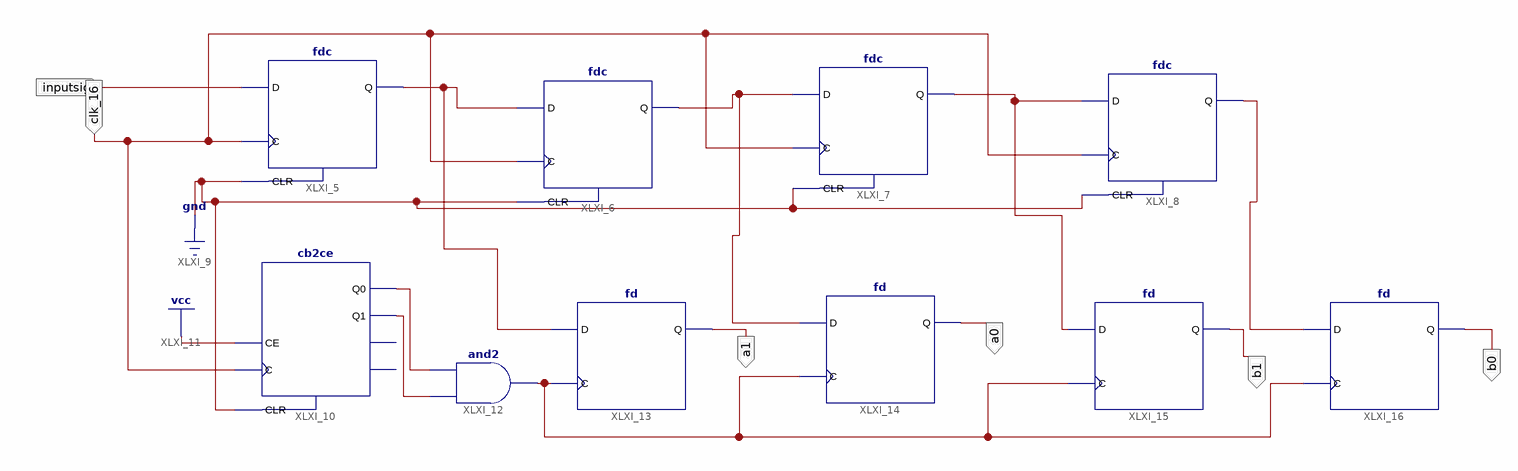
[diagram p0: schematic sheet 1]
// Xilinx ISE schematic bit4s.sch (spartan3) as structural Verilog: 10 symbols, 6 ports
module bit4s (
  input  clk_16,
  input  inputsig,
  output a1,
  output a0,
  output b0,
  output b1
);

  wire q1, q2, q3, q4, XLXN_13, XLXN_15, XLXN_16;

  fdc XLXI_5 (.C(clk_16), .CLR(1'b0), .D(inputsig), .Q(q1));
  fdc XLXI_6 (.C(clk_16), .CLR(1'b0), .D(q1), .Q(q2));
  fdc XLXI_7 (.C(clk_16), .CLR(1'b0), .D(q2), .Q(q3));
  fdc XLXI_8 (.C(clk_16), .CLR(1'b0), .D(q3), .Q(q4));
  cb2ce XLXI_10 (.C(clk_16), .CE(1'b1), .CLR(1'b0), .Q0(XLXN_13), .Q1(XLXN_15));  // open: CEO, TC
  and XLXI_12 (XLXN_16, XLXN_15, XLXN_13);
  fd XLXI_13 (.C(XLXN_16), .D(q1), .Q(a1));
  fd XLXI_14 (.C(XLXN_16), .D(q2), .Q(a0));
  fd XLXI_15 (.C(XLXN_16), .D(q3), .Q(b1));
  fd XLXI_16 (.C(XLXN_16), .D(q4), .Q(b0));
endmodule
